# Altium schematic sheet Juricic_Napajanje.SchDoc
size A
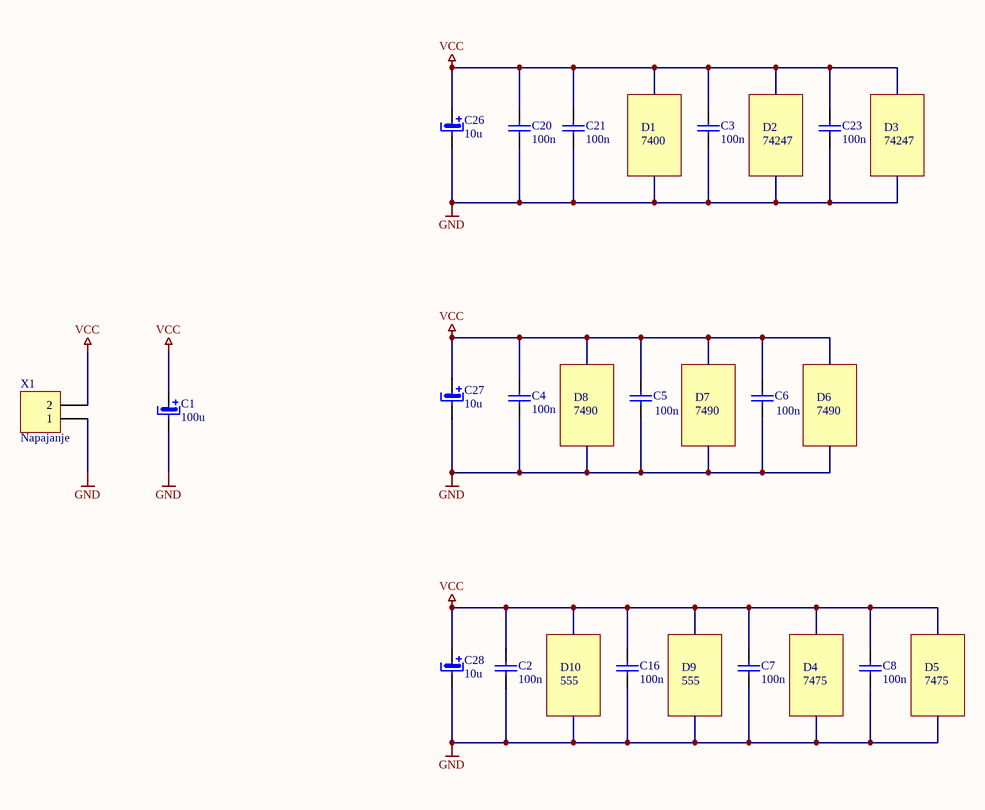
[diagram p0: Juricic_Napajanje.SchDoc]

## Parts
C1  100u  [CAPR5-4X5]
C2  100n  [C0805]
C3  100n  [C0805]
C4  100n  [C0805]
C5  100n  [C0805]
C6  100n  [C0805]
C7  100n  [C0805]
C8  100n  [C0805]
C16  100n  [C0805]
C20  100n  [C0805]
C21  100n  [C0805]
C23  100n  [C0805]
C26  10u  [CAPR5-4X5]
C27  10u  [CAPR5-4X5]
C28  10u  [CAPR5-4X5]
X1  Napajanje  [HDR1X2]

## Nets
GND: C1.2 C2.1 C3.1 C4.1 C5.1 C6.1 C7.1 C8.1 C16.1 C20.1 C21.1 C23.1 C26.2 C27.2 C28.2 X1.1
VCC: C1.1 C2.2 C3.2 C4.2 C5.2 C6.2 C7.2 C8.2 C16.2 C20.2 C21.2 C23.2 C26.1 C27.1 C28.1 X1.2

## Notes on the sheet
- D1
- 7400
- D2
- 74247
- D3
- D8
- 7490
- D7
- D6
- D10
- 555
- D9
- D4
- 7475
- D5

## Library data of the parts
C1 = Elko: 100u capacitor; Cijena: 0.299; Dobavljač: Farnell; Kat. broj: 1219466
C2-C8 C16 C20 C21 C23 = Cap: 100n capacitor; Kat. broj: 1759122; Cijena: 0.0233; Published: 8-Jun-2000; LatestRevisionDate: 17-Jul-2002; LatestRevisionNote: Re-released for DXP Platform.; PackageReference: RAD-0.3; Publisher: Altium Limited; PackageDescription: Radial Cap, Thru-Hole; 2 Leads; 0.3 in Pin Spacing
C26-C28 = Elko: 10u capacitor; Cijena: 0.214; Kat. broj: 1457413; Dobavljač: Farnell
X1 = Header 2: Header, 2-Pin; Kat. broj: 3417645; Cijena: 0.319; LatestRevisionDate: 17-Jul-2002; LatestRevisionNote: Re-released for DXP Platform.; Publisher: Altium Limited